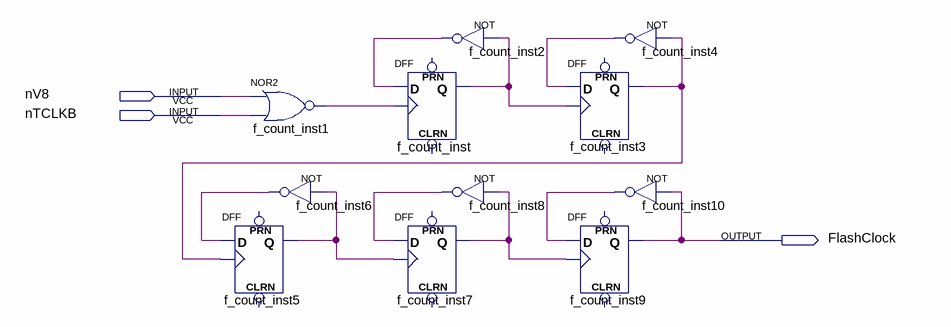
[diagram p0: schematic sheet]
// Quartus schematic ula_f_counter.bdf as structural Verilog: 11 symbols, 3 pins
module ula_f_counter (
  input  nV8,
  input  nTCLKB,
  output FlashClock
);

  wire f_count_inst1_out, f_count_inst2_out, f_count_inst3_q, f_count_inst4_out, f_count_inst5_q,
       f_count_inst6_out, f_count_inst7_q, f_count_inst8_out, f_count_inst10_out, f_count_inst_q;

  nor f_count_inst1 (f_count_inst1_out, nV8, nTCLKB);
  not f_count_inst6 (f_count_inst6_out, f_count_inst5_q);
  DFF f_count_inst5 (.CLK(f_count_inst3_q), .D(f_count_inst6_out), .Q(f_count_inst5_q));  // open: CLRN, PRN
  DFF f_count_inst (.CLK(f_count_inst1_out), .D(f_count_inst2_out), .Q(f_count_inst_q));  // open: CLRN, PRN
  DFF f_count_inst7 (.CLK(f_count_inst5_q), .D(f_count_inst8_out), .Q(f_count_inst7_q));  // open: CLRN, PRN
  not f_count_inst2 (f_count_inst2_out, f_count_inst_q);
  not f_count_inst8 (f_count_inst8_out, f_count_inst7_q);
  DFF f_count_inst3 (.CLK(f_count_inst_q), .D(f_count_inst4_out), .Q(f_count_inst3_q));  // open: CLRN, PRN
  DFF f_count_inst9 (.CLK(f_count_inst7_q), .D(f_count_inst10_out), .Q(FlashClock));  // open: CLRN, PRN
  not f_count_inst4 (f_count_inst4_out, f_count_inst3_q);
  not f_count_inst10 (f_count_inst10_out, FlashClock);
endmodule
